# EAGLE schematic Zoetrope (EAGLE 8.4.0)
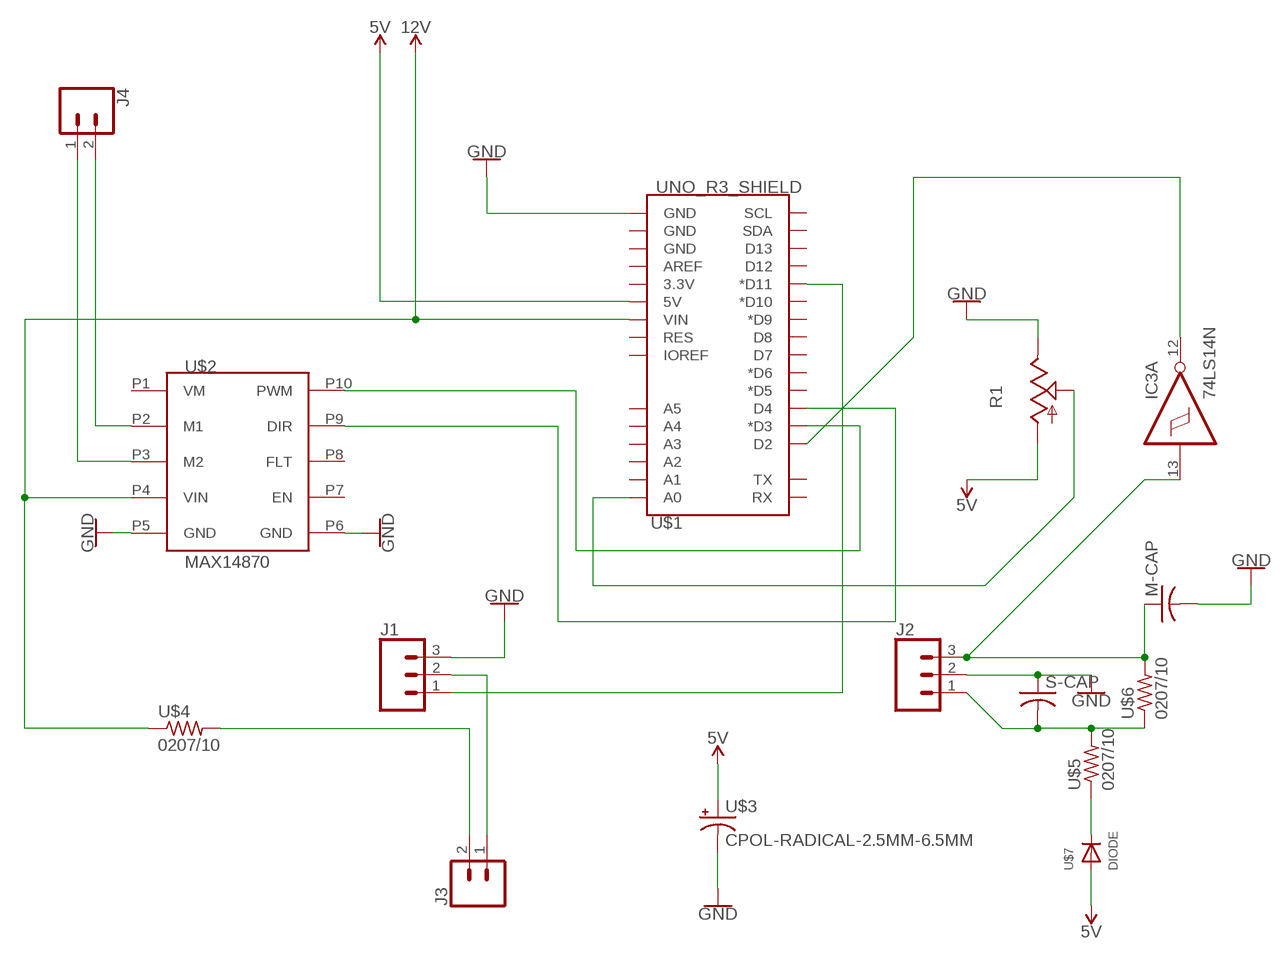
[diagram p0: schematic, sheet 1]

## Parts
IC3  74LS14N  [DIL14]
J1  CONN_03LOCK_LONGPADS  [1X03_LOCK_LONGPADS]
J2  CONN_03LOCK_LONGPADS  [1X03_LOCK_LONGPADS]
J3  CONN_02LOCK_LONGPADS  [1X02_LOCK_LONGPADS]
J4  CONN_02LOCK_LONGPADS  [1X02_LOCK_LONGPADS]
M-CAP  C-US050-030X075  [C050-030X075]
R1  TRIM_US-B25U  [B25U]
S-CAP  C-US025-030X050  [C025-030X050]
U$1  UNO_R3_SHIELD  [UNO_R3_SHIELD]
U$2  MAX14870  [MAX14870]
U$3  CPOL-RADICAL-2.5MM-6.5MM  [CPOL-RADIAL-2.5MM-6.5MM]
U$4  0207/10  [0207/10]
U$5  0207/10  [0207/10]
U$6  0207/10  [0207/10]
U$7  DIODE  [DO-1N4148]

## Nets
5V: R1.A U$1.5V U$3.1(+) U$7.A
12V: U$1.VIN U$2.P4(VIN) U$4.1
GND: J1.3 J2.2 M-CAP.2 R1.E S-CAP.1 U$1.GND@0(GND) U$2.P5(GND) U$2.P6(GND) U$3.2(-)
N$1: R1.S U$1.A0
N$4: IC3.13(A:I) J2.3 M-CAP.1 U$6.2
N$5: U$5.1 U$7.C
N$6: J2.1 S-CAP.2 U$5.2 U$6.1
N$7: IC3.12(A:O) U$1.D2
N$8: J1.1 U$1.D11(*D11)
N$9: J1.2 J3.1
N$10: J3.2 U$4.2
N$11: J4.2 U$2.P2(M1)
N$12: J4.1 U$2.P3(M2)
N$13: U$1.D3(*D3) U$2.P10(PWM)
N$14: U$1.D4 U$2.P9(DIR)
Unconnected: IC3.1(D:I) IC3.2(D:O) IC3.3(E:I) IC3.4(E:O) IC3.5(F:I) IC3.6(F:O) IC3.8(C:O) IC3.9(C:I) IC3.10(B:O) IC3.11(B:I) U$1.3.3V U$1.A1 U$1.A2 U$1.A3 U$1.A4 U$1.A5 U$1.AREF U$1.D5(*D5) U$1.D6(*D6) U$1.D7 U$1.D8 U$1.D9(*D9) U$1.D10(*D10) U$1.D12 U$1.D13 U$1.GND@1(GND) U$1.GND@2(GND) U$1.IOREF U$1.RES U$1.RX U$1.SCL U$1.SDA U$1.TX U$2.P1(VM) U$2.P7(EN) U$2.P8(FLT)

## Power pins joined to a net without a drawn wire
GND: IC3.7(P:GND)
VCC: IC3.14(P:VCC)

## Library data of the parts
IC3 = 74xx-us:74*14: Hex schmitt trigger INVERTER
J1 J2 = SparkFun-Connectors:CONN_03: Multi connection point. Often used as Generic Header-pin footprint for 0.1 inch spaced/style header connections On any of the 0.1 inch spaced packages, you can populate with these: Break Away Headers - Straight <https://www.sparkfun.com/products/116> (PRT-00116) Break Away Male Headers - Right Angle <https://www.sparkfun.com/products/553> (PRT-00553) Female Headers <https://www.sparkfun.com/products/115> (PRT-00115) Break Away Headers - Machine Pin <https://www.sparkfun.com/products/117> (PRT-00117) Break Away Female Headers - Swiss Machine Pin <https://www.sparkfun.com/products/743> (PRT-00743) Stackable Header - 3 Pin (Female, 0.1") <https://www.sparkfun.com/products/13875> (PRT-13875) For SCREWTERMINALS and SPRING TERMINALS visit here: Screw Terimnals on SparkFun.com <https://www.sparkfun.com/search/results?term=Screw+Terminals> (5mm/3.5mm/2.54mm spacing) This device is also useful as a general connection point to wire up your design to another part of your project. Our various solder wires solder well into these plated through hole pads. Hook-Up Wire - Assortment (Stranded, 22 AWG) <https://www.sparkfun.com/products/11375> (PRT-11375) Hook-Up Wire - Assortment (Solid Core, 22 AWG) <https://www.sparkfun.com/products/11367> (PRT-11367) View the entire wire category on our website here <https://www.sparkfun.com/categories/141> Special notes: Molex polarized connector foot print use with SKU : PRT-08232 with associated crimp pins and housings.
J3 J4 = SparkFun-Connectors:CONN_02: Multi connection point. Often used as Generic Header-pin footprint for 0.1 inch spaced/style header connections On any of the 0.1 inch spaced packages, you can populate with these: Break Away Headers - Straight <https://www.sparkfun.com/products/116> (PRT-00116) Break Away Male Headers - Right Angle <https://www.sparkfun.com/products/553> (PRT-00553) Female Headers <https://www.sparkfun.com/products/115> (PRT-00115) Break Away Headers - Machine Pin <https://www.sparkfun.com/products/117> (PRT-00117) Break Away Female Headers - Swiss Machine Pin <https://www.sparkfun.com/products/743> (PRT-00743) For SCREWTERMINALS and SPRING TERMINALS visit here: Screw Terimnals on SparkFun.com <https://www.sparkfun.com/search/results?term=Screw+Terminals> (5mm/3.5mm/2.54mm spacing) This device is also useful as a general connection point to wire up your design to another part of your project. Our various solder wires solder well into these plated through hole pads. Hook-Up Wire - Assortment (Stranded, 22 AWG) <https://www.sparkfun.com/products/11375> (PRT-11375) Hook-Up Wire - Assortment (Solid Core, 22 AWG) <https://www.sparkfun.com/products/11367> (PRT-11367) View the entire wire category on our website here <https://www.sparkfun.com/categories/141> Special notes: Molex polarized connector foot print use with: PRT-08233 with associated crimp pins and housings. 2.54_SCREWTERM for use with PRT-10571. 3.5mm Screw Terminal footprints for PRT-08084 5mm Screw Terminal footprints for use with PRT-08432
M-CAP S-CAP = adafruit:C-US: CAPACITOR, American symbol
R1 = pot:TRIM_US-: POTENTIOMETER
U$1 = nathan-library:UNO_R3_SHIELD
U$2 = nathan-library:MAX14870
U$3 = nathan-library:CPOL-RADICAL-2.5MM-6.5MM
U$4-U$6 = nathan-library:0207/10
U$7 = nathan-library:DIODE